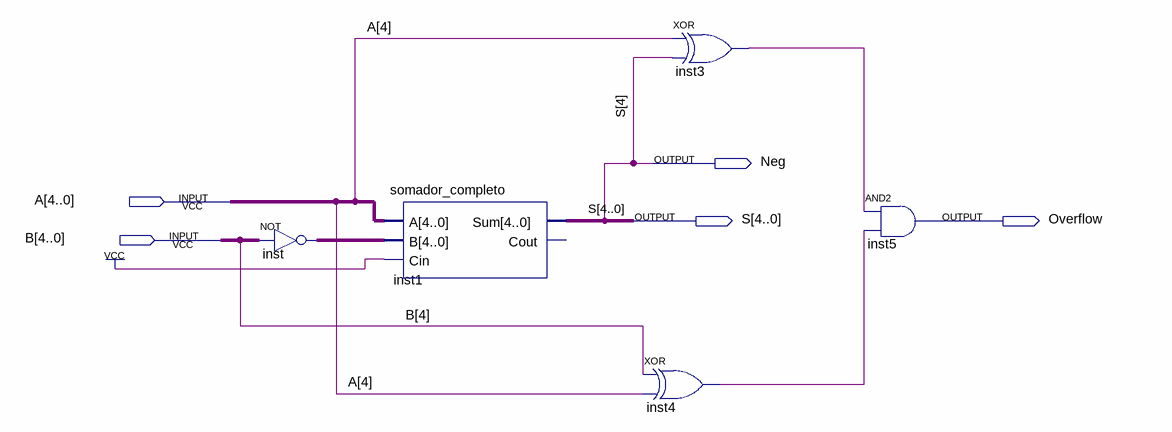
[diagram p0: schematic sheet]
// Quartus schematic subtrator_completo.bdf as structural Verilog: 5 symbols, 5 pins
module subtrator_completo (
  input  [4:0] A,
  input  [4:0] B,
  output Neg,
  output [4:0] S,
  output Overflow
);

  wire inst3_out, inst4_out;
  wire [4:0] inst_out;

  assign inst_out = ~B;  // NOT inst, 5 bits wide
  somador_completo inst1 (.A(A), .B(inst_out), .Cin(1'b1), .Sum({Neg, S[3:0]}));  // open: Cout
  xor inst3 (inst3_out, A[4], Neg);
  xor inst4 (inst4_out, B[4], A[4]);
  and inst5 (Overflow, inst3_out, inst4_out);

  assign S[4] = Neg;
endmodule
